# Altium schematic sheet NFC Business Card.SchDoc
size A4
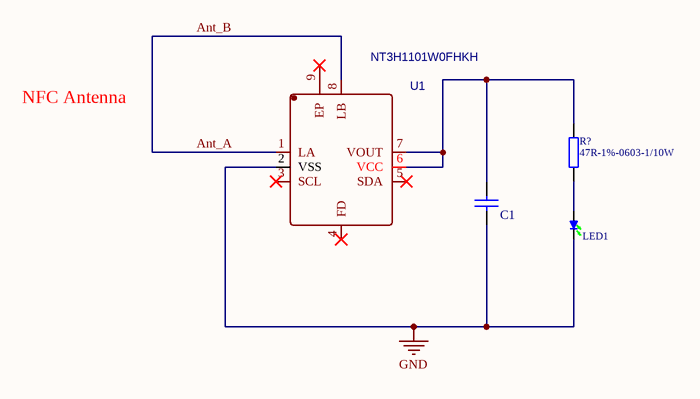
[diagram p0: NFC Business Card.SchDoc]

## Parts
C1  220nF-10%-50V-0603  [C0603]  (value not drawn)
LED1  LED-绿光-0603  [LED0603]  (value not drawn)
R?  47R-1%-0603-1/10W  [R0603]
U1  NT3H1101W0FHKH  [XQFN-8_L1.6-W1.6-P0.50-BL]

## Nets
GND: C1.1 LED1.1 U1.2(VSS)
Ant_A: U1.1(LA) U1.8(LB)  [also labelled Ant_B]
NetC1_2: C1.2 R?.2 U1.6(VCC) U1.7(VOUT)
NetLED1_2: LED1.2 R?.1

Not connected (* = marked no-connect by the designer): U1 3(SCL)* 4(FD)* 5(SDA)* 9(EP)*

## Notes on the sheet
- NFC Antenna

## Library data of the parts
C1 = 220nF-10%-50V-0603: 贴片电容; 物料编码: 9.02.0302.01.0012; Text Field2: 220N-10%F-50V-0603-X7R; 规格型号: 220nF-10%-50V-0603---(CC0603KRX7R9BB224); 厂家: 国巨
LED1 = LED-绿光-0603: 绿光; 物料编码: 9.03.0101.03.0001; 规格型号: 0603绿光--（19-217/G7C-AL1M2B/3T）; Text Field2: Vf=2.0V,If=25mA,Vr=5V,绿光,0603; 厂家: 台湾亿光
R? = 47K-1%-0603: 贴片电阻; Text Field2: 47K-1%-0603-1/10W; 规格型号: 47K-1%-0603---(RC0603FR-0747KL); 厂家: 国巨; 物料编码: 47K-1%-0603-1/10W
U1 = NT3H1101W0FHKH: BOM_Manufacturer: NXP Semicon; Contributor: LCSC; BOM_Supplier: LCSC; BOM_Supplier Part: C73156; BOM_Manufacturer Part: NT3H1101W0FHKH; spicePre: U; spiceSymbolName: NT3H1101W0FHKH